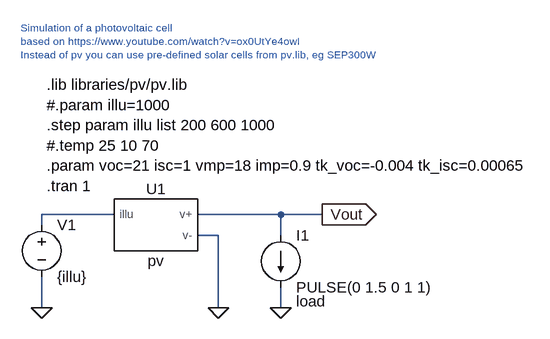
[diagram p0: schematic pv.asc]
pv.asc, the LTspice schematic file:
Version 4
SHEET 1 2932 1048
WIRE 592 384 480 384
WIRE 848 384 720 384
WIRE 912 384 848 384
WIRE 480 400 480 384
WIRE 752 416 720 416
WIRE 848 416 848 384
WIRE 480 528 480 480
WIRE 752 528 752 416
WIRE 848 528 848 496
FLAG 480 528 0
FLAG 848 528 0
FLAG 912 384 Vout
IOPIN 912 384 Out
FLAG 752 528 0
SYMBOL Voltage 480 384 R0
SYMATTR InstName V1
SYMATTR Value {illu}
SYMBOL pv 656 400 R0
SYMATTR InstName U1
SYMBOL current 848 416 R0
WINDOW 39 24 102 Left 2
SYMATTR InstName I1
SYMATTR Value PULSE(0 1.5 0 1 1)
SYMATTR SpiceLine load
TEXT 488 184 Left 2 !.lib libraries/pv/pv.lib\n#.param illu=1000\n.step param illu list 200 600 1000\n#.temp 25 10 70\n.param voc=21 isc=1 vmp=18 imp=0.9 tk_voc=-0.004 tk_isc=0.00065\n.tran 1
TEXT 448 96 Left 1 ;Simulation of a photovoltaic cell\nbased on https://www.youtube.com/watch?v=ox0UtYe4owI\nInstead of pv you can use pre-defined solar cells from pv.lib, eg SEP300W

The netlist it stands for:
* pv.asc
V1 N001 0 {illu}
XU1 Vout 0 N001 pv  ; pins v+ v- illu
I1 Vout 0 PULSE(0 1.5 0 1 1) load
.lib libraries/pv/pv.lib
#.param illu=1000
.step param illu list 200 600 1000
#.temp 25 10 70
.param voc=21 isc=1 vmp=18 imp=0.9 tk_voc=-0.004 tk_isc=0.00065
.tran 1
* Simulation of a photovoltaic cell
* based on https://www.youtube.com/watch?v=ox0UtYe4owI
* Instead of pv you can use pre-defined solar cells from pv.lib, eg SEP300W
.backanno
.end